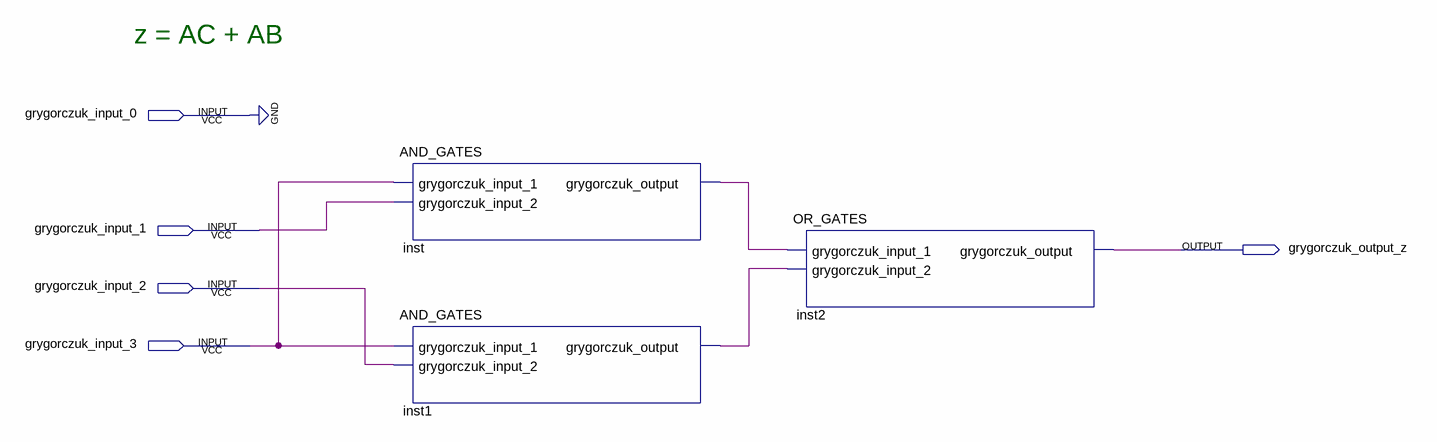
[diagram p0: schematic sheet]
// Quartus schematic COMPARATOR_GATES.bdf as structural Verilog: 3 symbols, 5 pins
module COMPARATOR_GATES (
  input  grygorczuk_input_0,
  input  grygorczuk_input_1,
  input  grygorczuk_input_2,
  input  grygorczuk_input_3,
  output grygorczuk_output_z
);

  wire inst1_grygorczuk_output, inst_grygorczuk_output;

  AND_GATES inst (
    .grygorczuk_input_1(grygorczuk_input_3), .grygorczuk_input_2(grygorczuk_input_1),
    .grygorczuk_output(inst_grygorczuk_output));
  AND_GATES inst1 (
    .grygorczuk_input_1(grygorczuk_input_3), .grygorczuk_input_2(grygorczuk_input_2),
    .grygorczuk_output(inst1_grygorczuk_output));
  OR_GATES inst2 (
    .grygorczuk_input_1(inst_grygorczuk_output), .grygorczuk_input_2(inst1_grygorczuk_output),
    .grygorczuk_output(grygorczuk_output_z));
  // also tied to GND on the sheet: grygorczuk_input_0

  // Notes on the sheet:
  //   z = AC + AB
endmodule
